# EAGLE schematic brick_i2c_barometer (EAGLE 7.4.0)
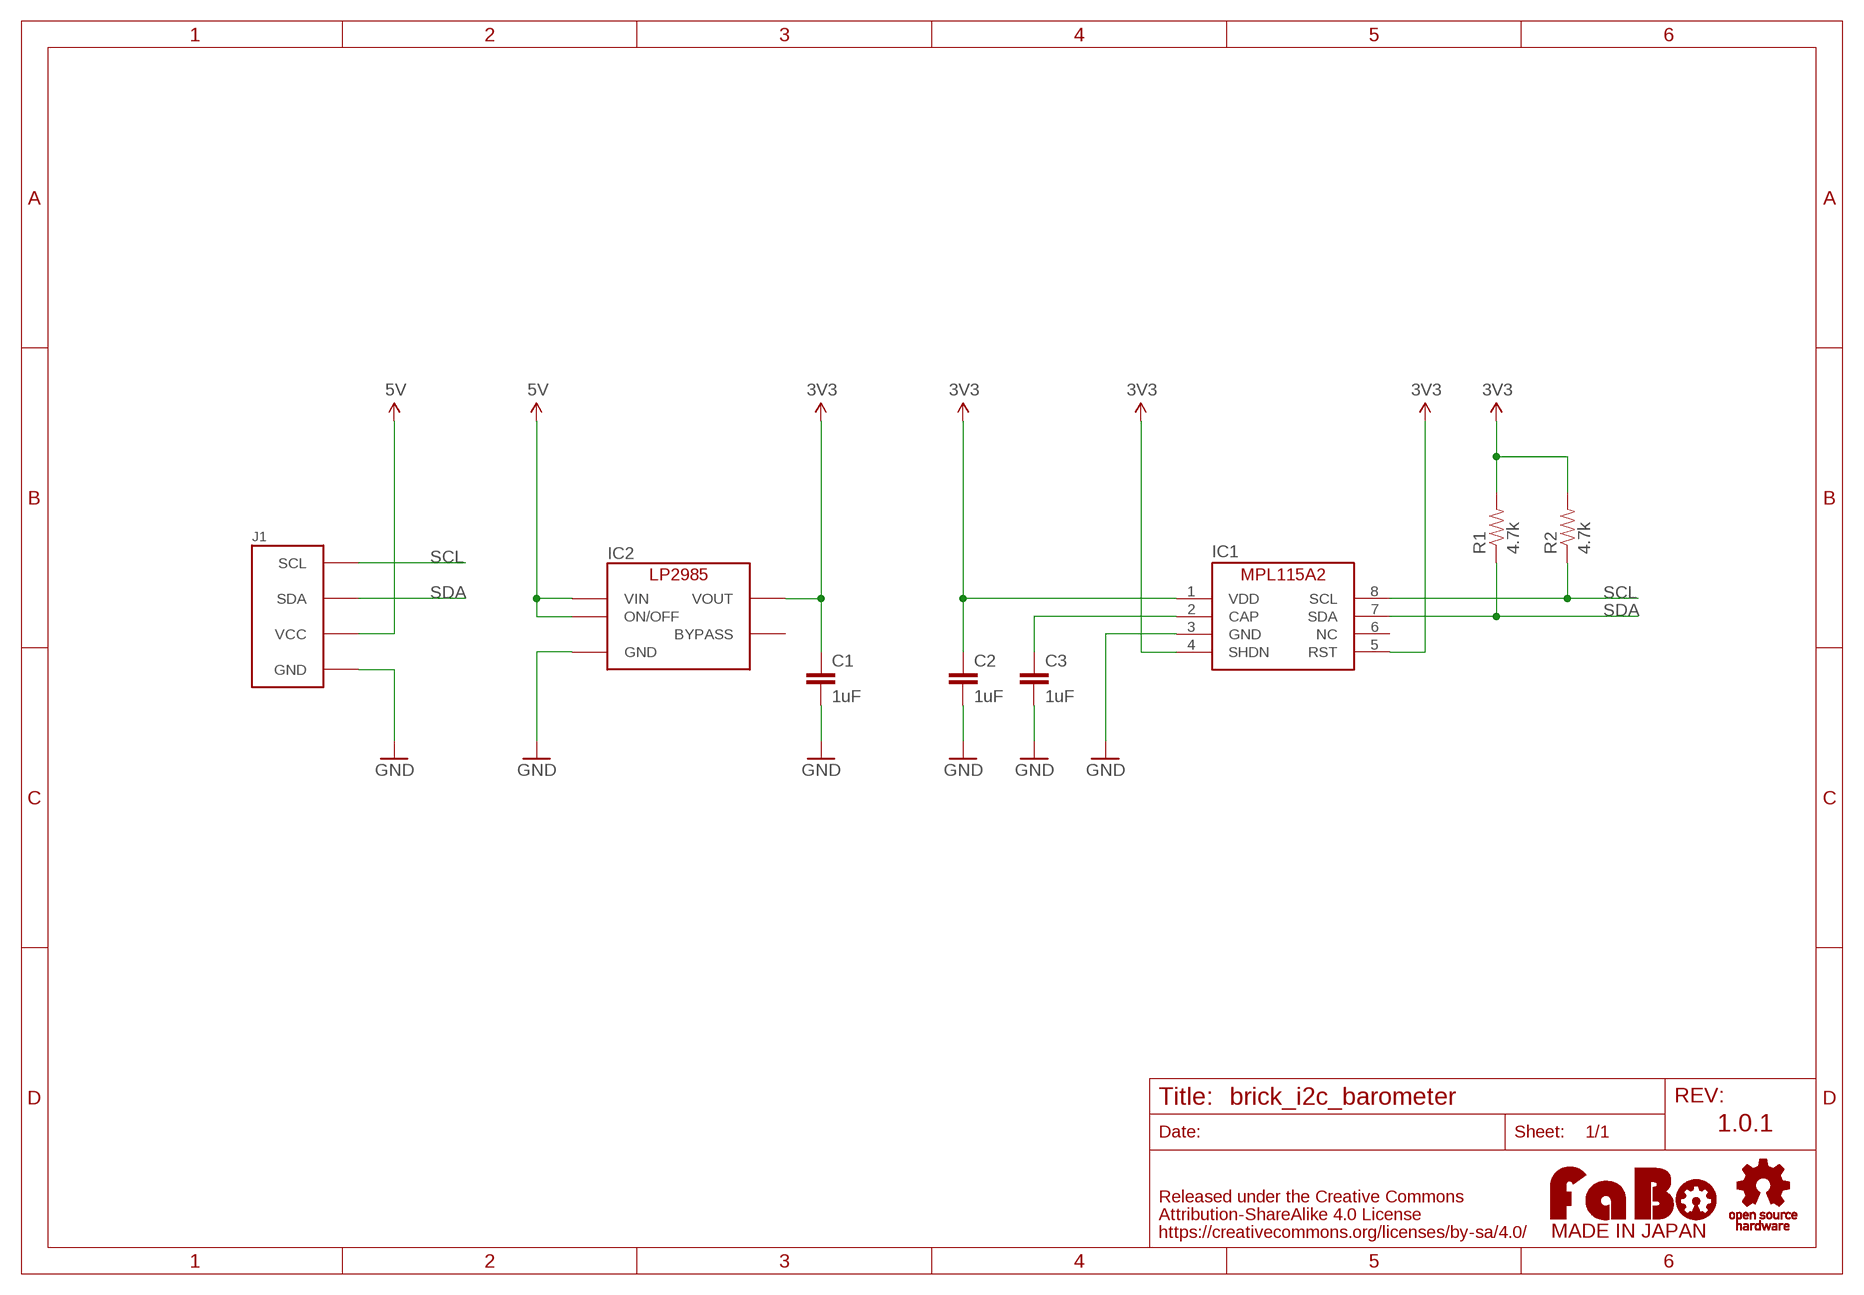
[diagram p0: schematic, sheet 1]

## Parts
C1  1uF  CAP-EIA0603  [EIA0603]
C2  1uF  CAP-EIA0603  [EIA0603]
C3  1uF  CAP-EIA0603  [EIA0603]
IC1  FS-MPL115A2  [FREESCALE-MPL115A2]
IC2  TI-LP2985-33DBVR  [TI-LP2985]
J1  FABO_BRICK_I2C  [FABO_BRICK_I2C]
R1  4.7k  RES-EIA0603  [EIA0603]
R2  4.7k  RES-EIA0603  [EIA0603]
U$3  LOGO_OSHW-T_M  [LOGO_OSHW_T_M]
U$4  LOGO_FABO-M  [LOGO_FABO_M]

## Nets
3V3: C1.1 C2.1 IC1.1(VDD) IC1.4(SHDN) IC1.5(RST) IC2.5(VOUT) R1.2 R2.2
5V: IC2.1(VIN) IC2.3(ON/OFF) J1.VCC
GND: C1.2 C2.2 C3.2 IC1.3(GND) IC2.2(GND) J1.GND
N$2: C3.1 IC1.2(CAP)
SCL: IC1.8(SCL) J1.SCL R2.1
SDA: IC1.7(SDA) J1.SDA R1.1
Unconnected: IC1.6(NC) IC2.4(BYPASS)

## Notes on the sheet
- 1.0.1

## Library data of the parts
C1-C3 = FaBo-etc:CAP: Capacitor Standard 0603 ceramic capacitor
IC1 = FaBo-Mems:FS-MPL115A2: FREESCALE MPL115A2(Atmospheric pressure)
IC2 = FaBo-Supply:TI-LP2985: LP2985
J1 = FaBo-Template:FABO_BRICK_I2C: FaBo Brick I2C
R1 R2 = FaBo-etc:RES
U$3 = FaBo-etc:LOGO_OSHW
U$4 = FaBo-etc:LOGO_FABO